# EAGLE design atsamd21_breakout_board (EAGLE 7.7.0)
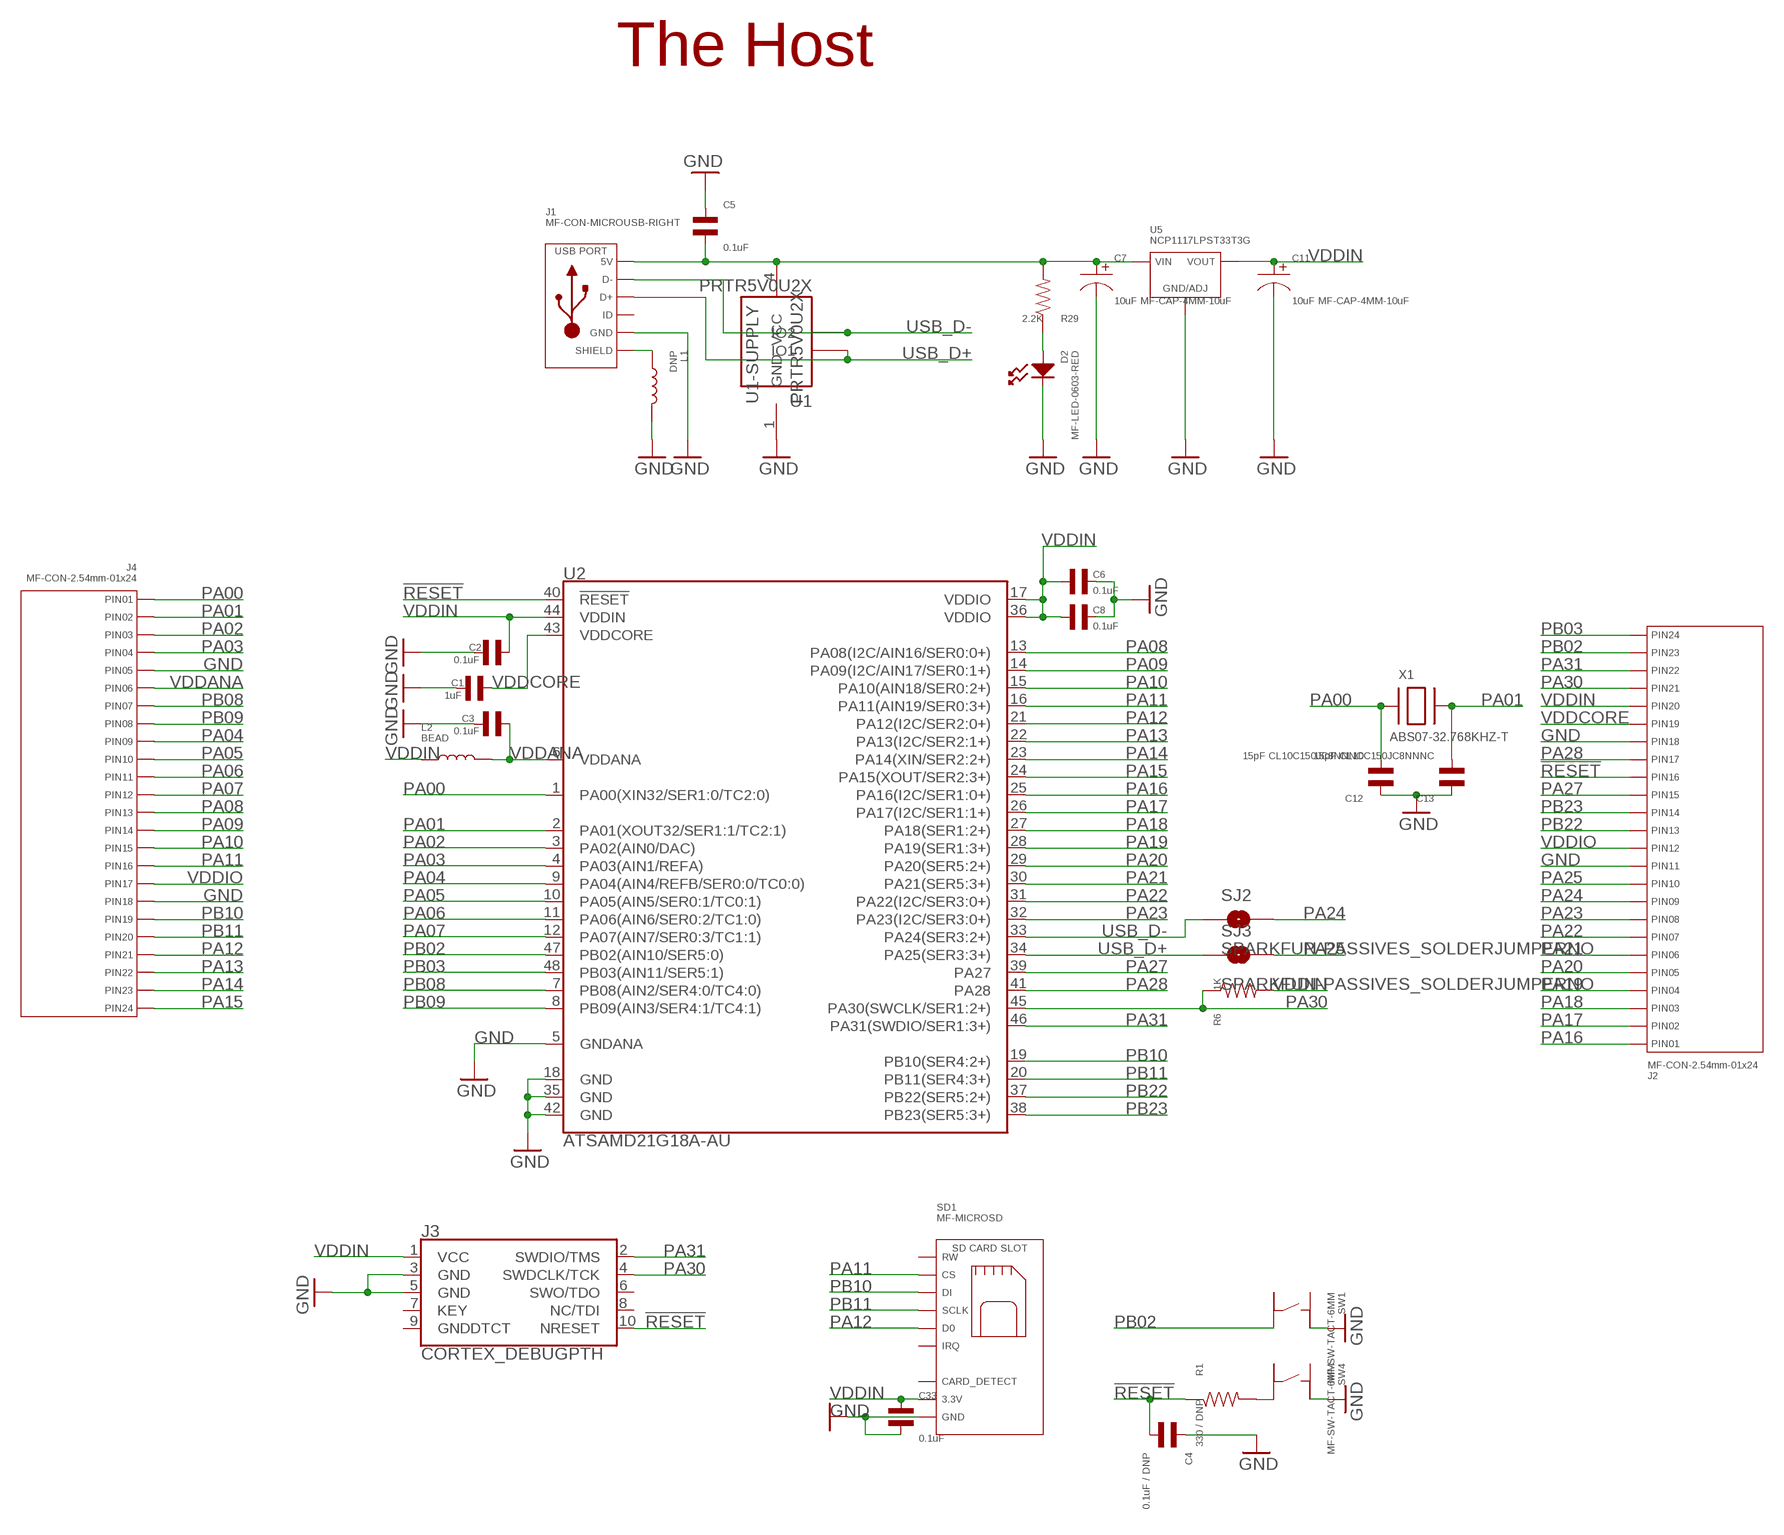
[diagram p0: schematic, sheet 1]

## Parts
C1  1uF  CAPACITOR_NP_0603  [C0603]
C2  0.1uF  CAPACITOR_NP_0603  [C0603]
C3  0.1uF  CAPACITOR_NP_0603  [C0603]
C4  0.1uF / DNP  CAPACITOR_NP_0603  [C0603]
C5  0.1uF  CAPACITOR_NP_0603  [C0603]
C6  0.1uF  CAPACITOR_NP_0603  [C0603]
C7  10uF MF-CAP-4MM-10uF  CAPACITOR_P_4MM  [CP4MM]
C8  0.1uF  CAPACITOR_NP_0603  [C0603]
C11  10uF MF-CAP-4MM-10uF  CAPACITOR_P_4MM  [CP4MM]
C12  15pF CL10C150JC8NNNC  CAPACITOR_NP_0603  [C0603]
C13  15pF CL10C150JC8NNNC  CAPACITOR_NP_0603  [C0603]
C33  0.1uF  CAPACITOR_NP_0603  [C0603]
D2  MF-LED-0603-RED  LED_SINGLE-0603-RED  [LED0603]
J1  MF-CON-MICROUSB-RIGHT  USB_MICRO_RIGHT  [MICROUSB-RIGHT]
J2  MF-CON-2.54mm-01x24  CON_01X24_PTH_2.54MM  [PTH_2.54MM_01X24]
J3  CORTEX_DEBUGPTH  [2X5-PTH-1.27MM]
J4  MF-CON-2.54mm-01x24  CON_01X24_PTH_2.54MM  [PTH_2.54MM_01X24]
L1  DNP  INDUCTOR_1210  [L1210]
L2  BEAD  INDUCTOR_1210  [L1210]
R1  330 / DNP  RESISTOR_0603  [R0603]
R6  1K  RESISTOR_0603  [R0603]
R29  2.2K  RESISTOR_0603  [R0603]
SD1  MF-MICROSD  SD_CARD_SLOT_MICRO_RIGHT  [MF-MICROSD]
SJ2  SPARKFUN-PASSIVES_SOLDERJUMPERNO  [SPARKFUN-PASSIVES_SJ_2S-NO]
SJ3  SPARKFUN-PASSIVES_SOLDERJUMPERNO  [SPARKFUN-PASSIVES_SJ_2S-NO]
SW1  MF-SW-TACT-6MM  TACT_6MM  [TACT6MM]
SW4  MF-SW-TACT-6MM  TACT_6MM  [TACT6MM]
U1  PRTR5V0U2X  [SOT-143B]
U2  ATSAMD21G18A-AU  ATSAMD21G-A  [TQFP-48]
U5  NCP1117LPST33T3G  [SOT-223-3]
X1  ABS07-32.768KHZ-T  XTAL-3.2X1.5  [XTAL3215]

## Nets
!RESET: C4.P$2 J2.P$16(PIN16) J3.10(NRESET) R1.P$1 U2.40(!RESET!)
GND [Power]: C1.P$2 C2.P$1 C3.P$1 C4.P$1 C5.P$1 C6.P$1 C7.P$2 C8.P$1 C11.P$2 C12.P$1 C13.P$1 C33.P$2 D2.CATHODE J1.5(GND) J2.P$11(PIN11) J2.P$18(PIN18) J3.3(GND) J3.5(GND) J4.P$5(PIN5) J4.P$18(PIN18) L1.P$2 SD1.G0(GND) SD1.G1(GND) SD1.PIN6(GND) SW1.P$2 SW4.P$2 U1.1(GND) U2.5(GNDANA) U2.18(GND) U2.35(GND) U2.42(GND) U5.P$2(GND/ADJ)
N$9: R1.P$2 SW4.P$4
N$10: J1.S1(SLD) J1.S2(SLD) J1.S3(SLD) J1.S4(SLD) J1.S5(SLD) J1.S6(SLD) L1.P$1
N$18: D2.ANODE R29.P$1
N$25: C5.P$2 C7.P$1 J1.1(5V) R29.P$2 U1.4(VCC) U5.P$4(VIN)
PA00: C12.P$2 J4.P$1(PIN1) U2.1(PA00(XIN32/SER1:0/TC2:0)) X1.P$1
PA01: C13.P$2 J4.P$2(PIN2) U2.2(PA01(XOUT32/SER1:1/TC2:1)) X1.P$2
PA02: J4.P$3(PIN3) U2.3(PA02(AIN0/DAC))
PA03: J4.P$4(PIN4) U2.4(PA03(AIN1/REFA))
PA04: J4.P$9(PIN9) U2.9(PA04(AIN4/REFB/SER0:0/TC0:0))
PA05: J4.P$10(PIN10) U2.10(PA05(AIN5/SER0:1/TC0:1))
PA06: J4.P$11(PIN11) U2.11(PA06(AIN6/SER0:2/TC1:0))
PA07: J4.P$12(PIN12) U2.12(PA07(AIN7/SER0:3/TC1:1))
PA08: J4.P$13(PIN13) U2.13(PA08(I2C/AIN16/SER0:0+))
PA09: J4.P$14(PIN14) U2.14(PA09(I2C/AIN17/SER0:1+))
PA10: J4.P$15(PIN15) U2.15(PA10(AIN18/SER0:2+))
PA11: J4.P$16(PIN16) SD1.PIN2(CS) U2.16(PA11(AIN19/SER0:3+))
PA12: J4.P$21(PIN21) SD1.PIN7(D0) U2.21(PA12(I2C/SER2:0+))
PA13: J4.P$22(PIN22) U2.22(PA13(I2C/SER2:1+))
PA14: J4.P$23(PIN23) U2.23(PA14(XIN/SER2:2+))
PA15: J4.P$24(PIN24) U2.24(PA15(XOUT/SER2:3+))
PA16: J2.P$1(PIN1) U2.25(PA16(I2C/SER1:0+))
PA17: J2.P$2(PIN2) U2.26(PA17(I2C/SER1:1+))
PA18: J2.P$3(PIN3) U2.27(PA18(SER1:2+))
PA19: J2.P$4(PIN4) U2.28(PA19(SER1:3+))
PA20: J2.P$5(PIN5) U2.29(PA20(SER5:2+))
PA21: J2.P$6(PIN6) U2.30(PA21(SER5:3+))
PA22: J2.P$7(PIN7) U2.31(PA22(I2C/SER3:0+))
PA23: J2.P$8(PIN8) U2.32(PA23(I2C/SER3:0+))
PA24: J2.P$9(PIN9) SJ2.2
PA25: J2.P$10(PIN10) SJ3.2
PA27: J2.P$15(PIN15) U2.39(PA27)
PA28: J2.P$17(PIN17) U2.41(PA28)
PA30: J2.P$21(PIN21) J3.4(SWDCLK/TCK) R6.P$1 U2.45(PA30(SWCLK/SER1:2+))
PA31: J2.P$22(PIN22) J3.2(SWDIO/TMS) U2.46(PA31(SWDIO/SER1:3+))
PB02: J2.P$23(PIN23) SW1.P$4 U2.47(PB02(AIN10/SER5:0))
PB03: J2.P$24(PIN24) U2.48(PB03(AIN11/SER5:1))
PB08: J4.P$7(PIN7) U2.7(PB08(AIN2/SER4:0/TC4:0))
PB09: J4.P$8(PIN8) U2.8(PB09(AIN3/SER4:1/TC4:1))
PB10: J4.P$19(PIN19) SD1.PIN3(DI) U2.19(PB10(SER4:2+))
PB11: J4.P$20(PIN20) SD1.PIN5(SCLK) U2.20(PB11(SER4:3+))
PB22: J2.P$13(PIN13) U2.37(PB22(SER5:2+))
PB23: J2.P$14(PIN14) U2.38(PB23(SER5:3+))
USB_D+: J1.3(D+) SJ3.1 U1.2(IO1) U2.34(PA25(SER3:3+))
USB_D-: J1.2(D-) SJ2.1 U1.3(IO2) U2.33(PA24(SER3:2+))
VDDANA: C3.P$2 J4.P$6(PIN6) L2.P$2 U2.6(VDDANA)
VDDCORE: C1.P$1 J2.P$19(PIN19) U2.43(VDDCORE)
VDDIN: C2.P$2 C6.P$2 C8.P$2 C11.P$1 C33.P$1 J2.P$20(PIN20) J3.1(VCC) L2.P$1 R6.P$2 SD1.PIN4(3.3V) U2.17(VDDIO) U2.36(VDDIO) U2.44(VDDIN) U5.P$1(VOUT) U5.P$3(VOUT)
VDDIO: J2.P$12(PIN12) J4.P$17(PIN17)
Unconnected: J1.4(ID) J3.6(SWO/TDO) J3.7(KEY) J3.8(NC/TDI) J3.9(GNDDTCT) SD1.PIN1(RW) SD1.PIN8(IRQ) SD1.PIN9(CRD_DTCT) SD1.PIN10(CRD_DTCT) SW1.P$1 SW1.P$3 SW4.P$1 SW4.P$3

## Notes on the sheet
- The Host

## Library data of the parts
C1-C6 C8 C12 C13 C33 = MF_Passives:CAPACITOR_NP: Library: MF_Passives Description: Device for Non-Polarized Capacitors. Manufacture part number (MPN) can be added via Attributes. Check https://factory.macrofab.com/parts for the house parts list.; POPULATE: 1
C7 C11 = MF_Passives:CAPACITOR_P: Library: MF_Passives Description: Device for Polarized Capacitors. Manufacture part number (MPN), Voltage Rating, and Tolerance can be added via Attributes. Check https://factory.macrofab.com/parts for the house parts list.; POPULATE: 1
D2 = MF_LEDs:LED_SINGLE: Library: MF_LEDs Description: Device for Single LED Packages. Manufacture part number (MFG#) can be added via Attributes.; HOUSEPART: YES; MPN: MF-LED-0603-RED; POPULATE: 1; URL: https://factory.macrofab.com/part/MF-LED-0603-RED
J1 = MF_Connectors:USB: Library: MF_Connectors Description: 5 Pin USB Connectors. SLD is the shield connection. Usually tied to ground through a small ferrite bead.; HOUSEPART: YES; MPN: MF-CON-MICROUSB-RIGHT; POPULATE: 1; URL: https://factory.macrofab.com/part/MF-CON-MICROUSB-RIGHT
J2 J4 = MF_Connectors:CON_01X24: Library: MF_Connectors Description: Header Connector with 24 Positions and 01 Rows. Use the LABEL Attribute to label the pin on the schematic and PCB. You can remove the attributes on the PCB by using the SMASH function on the part and then deleting the text.; HOUSEPART: YES; MPN: MF-CON-2.54mm-01x24; POPULATE: 1; URL: https://factory.macrofab.com/part/MF-CON-2.54mm-01x24
J3 = SparkFun-Connectors:CORTEX_DEBUG: Cortex Debug Connector Datasheet <http://infocenter.arm.com/help/topic/com.arm.doc.faqs/attached/13634/cortex_debug_connectors.pdf>
L1 L2 = MF_Passives:INDUCTOR: Library: MF_Passives Description: Device for Inductors. Manufacture part number (MPN) can be added via Attributes. Check https://factory.macrofab.com/parts for the house parts list.
R1 R6 R29 = MF_Passives:RESISTOR: Library: MF_Passives Description: Device for Resistors. Manufacture part number (MPN), Voltage, Tolerance, and Wattage Rating can be added via Attributes. Check https://factory.macrofab.com/parts for the house parts list.; POPULATE: 1
SD1 = MF_Connectors:SD_CARD_SLOT: Library: MF_Connectors Description: SD Card Connector; HOUSEPART: YES; MPN: MF-MICROSD; POPULATE: 1; URL: https://factory.macrofab.com/part/MF-MICROSD
SJ2 SJ3 = passKeyDev2:SPARKFUN-PASSIVES_SOLDERJUMPER: Solder Jumper Standard SMD solder jumper. Used to automate production. Two varients : Normally Open and Normally Closed are the same, but have different paste layers. NC will have a large amount of paste and should jumper during reflow.
SW1 SW4 = MF_Switches:TACT: Library: MF_Switches Description: Device for Tact Switches. Manufacture part number (MFG#) can be added via Attributes.; HOUSEPART: YES; MPN: MF-SW-TACT-6MM; POPULATE: 1; URL: https://factory.macrofab.com/part/MF-SW-TACT-6MM
U1 = Volks73-NXPSemiconductors:PRTR5V0U2X?: I2C-Bus EDS Protection Ulta low capacitance double rail-to-rail ESD protection diode Documentation Datasheet <http://www.nxp.com/documents/data_sheet/PRTR5V0U2X.pdf> General Description Ultra low capacitance rail-to-rail ElectroStatic Discharge (ESD) protection diode in a small SOT143B Surface-Mounted Device (SMD) plastic package designed to protect two Hi-Speed data lines or high-frequency signal lines from the damage caused by ESD and other transients. PRTR5V0U2X incorporates two pairs of ultra low capacitance rail-to-rail diodes as well as an additional ESD protection diode to ensure signal line protection even if no supply voltage is available. Features ESD protection of two Hi-Speed data lines or high-frequency signal lines Ultra low input/output to ground capacitance: C(I/O-GND) = 1 pF ESD protection up to 8kV IEC 61000-4-2, level 4 (ESD) Very low clamping voltage due to an integrated additional ESD protection diode Very low reverse current Small SMD plastic package Applications USB 2.0 ports Digital Video Interface (DVI)/High Definition Multimedia Interface (HDMI) interfaces Mobile and cordless phones Personal Digital Assistants (PDA) Digital Cameras Wide Area Network (WAN) / Local Area Network (LAN) systems PCs, notebooks, printers, and other PC peripherals; APPLICATIONS: General Purpose; BIDIRECTIONAL_CHANNELS: 2; CAPACITANCE: 1pF @ 1MHz; CURRENT_PEAK_PULSE: -; DESCRIPTION: TVS DIODE 5.5VWM SOT143B; DOCUMENTATION_LINK: <a href="http://www.nxp.com/documents/data_sheet/PRTR5V0U2X.pdf">Datasheet</a>; DOCUMENTATION_URL: http://www.nxp.com/documents/data_sheet/PRTR5V0U2X.pdf; MANUFACTURER: NXP Semiconductors; MOUNTING_TYPE: Surface Mount; OPERATING_TEMPERATURE: -40C ~ 85C; PART_NUMBER: PRTR5V0U2X,215; POWER-PEAK_PULSE: -; POWER_LINE_PROTECTION: Yes; SUPPLIER_ITEM_LINK: <a href="http://www.digikey.com/product-detail/en/PRTR5V0U2X,215/568-4140-1-ND/1589981">Details</a>; SUPPLIER_ITEM_NUMBER: 568-4140-1-ND; SUPPLIER_ITEM_URL: http://www.digikey.com/product-detail/en/PRTR5V0U2X,215/568-4140-1-ND/1589981; SUPPLIER_LINK: <a href="http://www.digikey.com">Home Page</a>; SUPPLIER_NAME: Digi-Key; SUPPLIER_URL: http://www.digikey.com; TYPE: Steering (Rail to Rail); UNIDIRECTIONAL_CHANNELS: -; VOLTAGE_BREAKDOWN: 6V; VOLTAGE_CLAMPING: -; VOLTAGE_REVERSE: 5.5V
U2 = SparkFun-DigitalIC:ATSAMD21G: Atmel SAMD21G SMART ARM-Based Microcontroller The Atmel ® | SMART ™ SAM D21 is a series of low-power microcontrollers using the 32-bit ARM ® Cortex ® -M0+ processor, and ranging from 32- to 64-pins with up to 256KB Flash and 32KB of SRAM. The SAM D21 devices operate at a maximum frequency of 48MHz and reach 2.46 CoreMark/MHz. They are designed for simple and intuitive migration with identical peripheral modules, hex compatible code, identical linear address map and pin compatible migration paths between all devices in the product series. All devices include intelligent and flexible peripherals, Atmel Event System for inter-peripheral signaling, and support for capacitive touch button, slider and wheel user interfaces.; PROD_ID: IC-13064
U5 = MF_IC_Power:NCP1117LP: Manufacturer Part #: NCP1117LP Manufacturer: ON Semiconductor Description: LDO Voltage Regulators; HOUSEPART: NO; MPN: NCP1117LPST33T3G; POPULATE: 1; URL: http://www.onsemi.com/pub_link/Collateral/NCP1117LP-D.PDF
X1 = adafruit:XTAL: Low cost SMT crystals, no capacitors included http://www.ladyada.net/library/eagle

## Net classes
1 Power: width 0.406 mm, clearance 0.203 mm

## Board
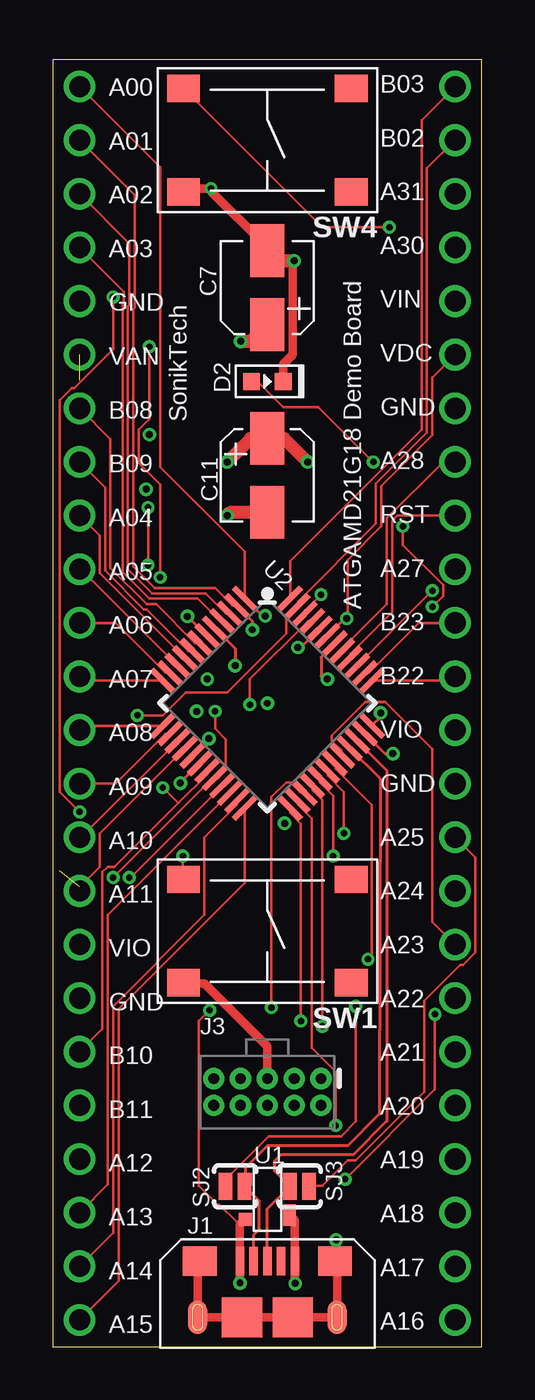
[diagram p1: board, top side]
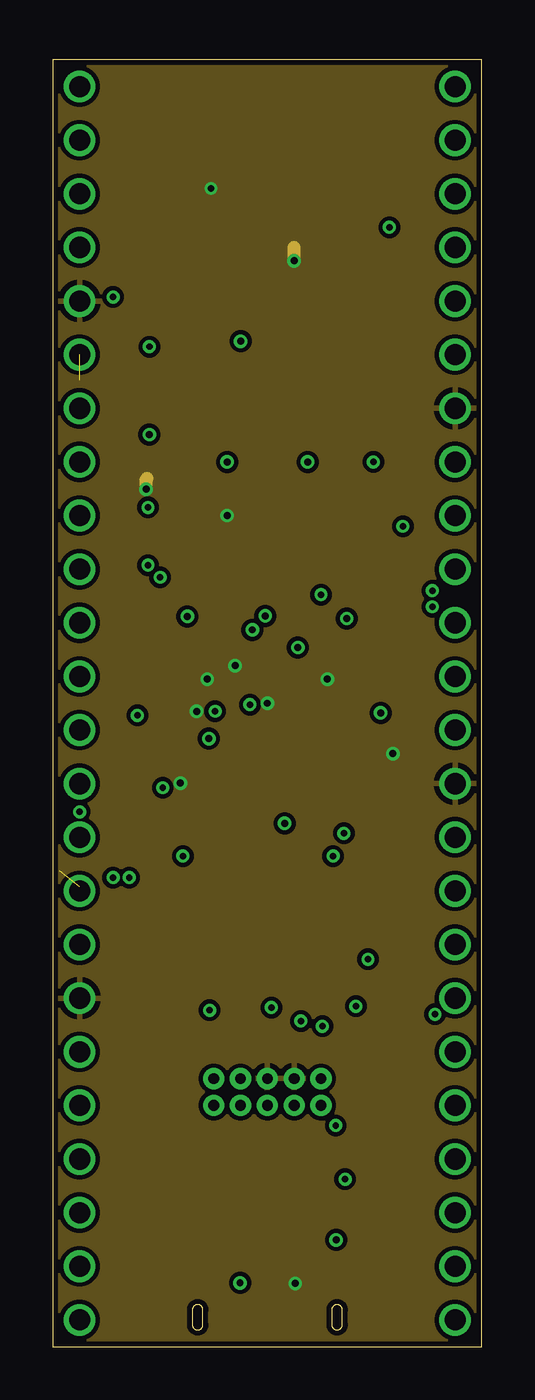
[diagram p2: board, inner layer Route2]
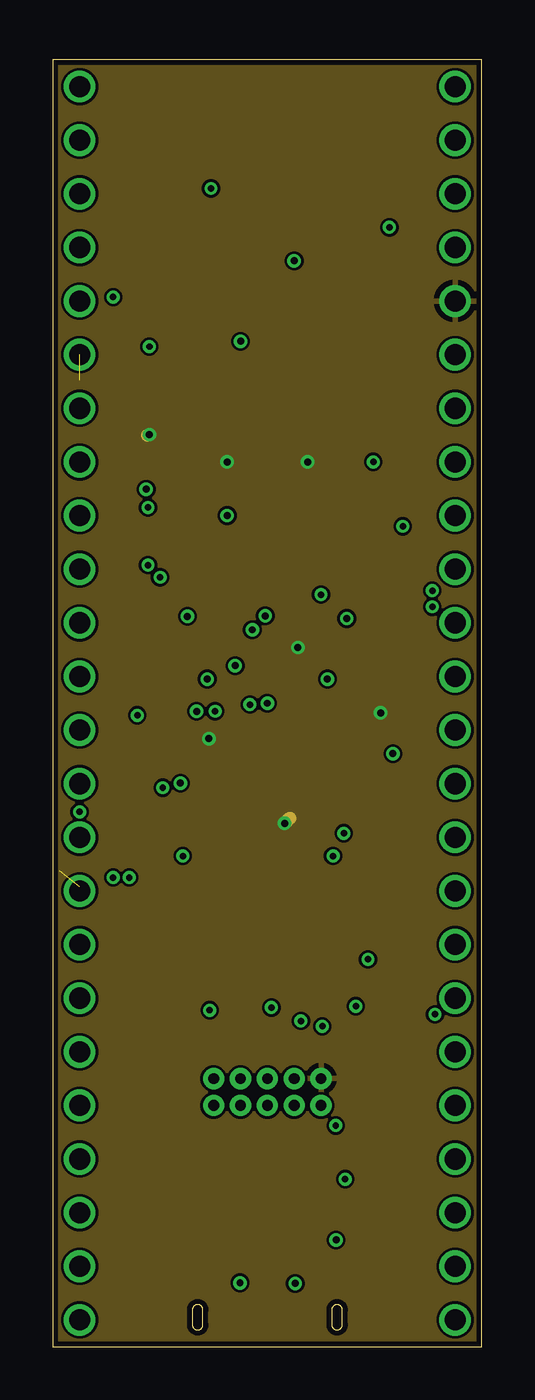
[diagram p3: board, inner layer Route15]
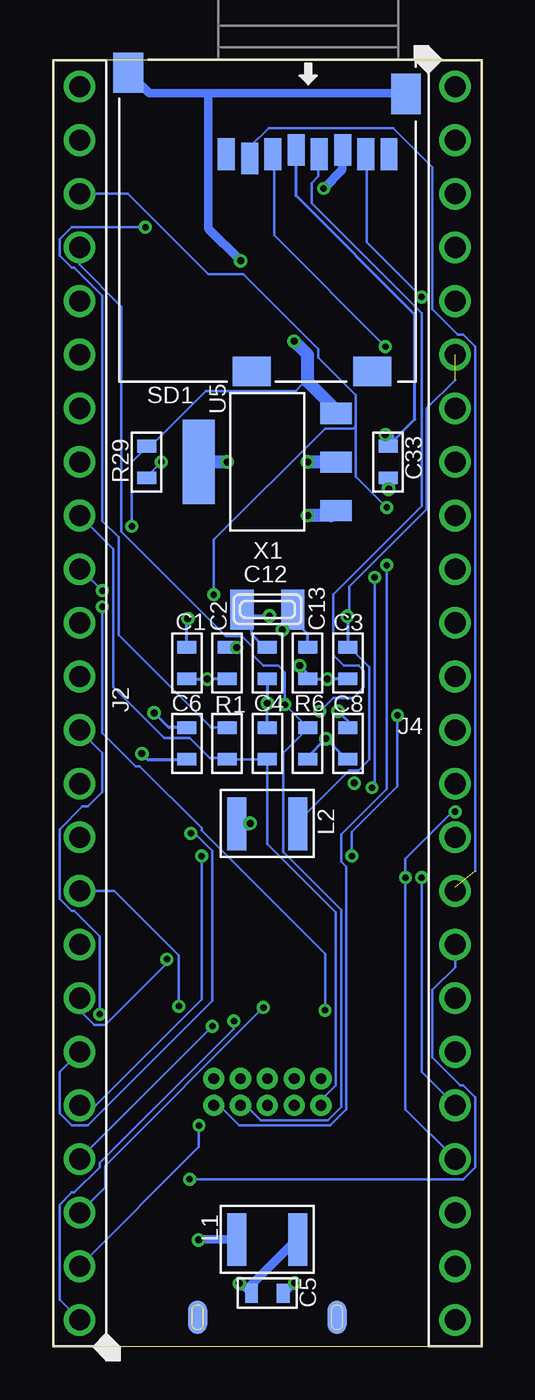
[diagram p4: board, bottom side, seen from below]

Size 20.32 x 60.96 mm. Coordinates in mm from the lower left corner, seen from the top.
Outline: 0,0 20.32,0 20.32,60.96 0,60.96 0,0
Copper layers (1*2*15*16): Top 0.035mm / dielectric 0.23mm / Route2 0.035mm / dielectric 0.93mm / Route15 0.035mm / dielectric 0.23mm / Bottom 0.035mm
Design rules "MF_Standard_4_Layer": minimum track width 5mil, minimum drill 12mil, track to track 5mil, track to pad 5mil, pad to pad 5mil, via to via 5mil, smd to smd 0mil, copper to edge 10mil, drill to drill 10mil, minimum pad ring 6mil, minimum via ring 6mil, stop-mask expansion 2mil, vias tented up to drill 25mil, thermal gap 10mil

### Footprints (pad centres in the part's own frame; a part is rotated, then mirrored left to right if it is on the bottom)
C0603 = smd 0.6 x 0.9: P$1 -0.75,0; P$2 0.75,0
CP4MM = smd 1.6 x 2.5: P$1 0,-1.75; P$2 0,1.75
LED0603 = smd 0.8 x 0.8: ANODE 0.75,0; CATHODE -0.75,0
MICROUSB-RIGHT = smd 0.4 x 1.35: 1 -1.3,1.27; 2 -0.65,1.27; 3 0,1.27; 4 0.65,1.27; 5 1.3,1.27 | smd 0.9 x 1.6: S1 -3.3,-1.4; S2 3.3,-1.4 | smd 1.6 x 1.4: S3 -3.2,1.27; S4 3.2,1.27 | smd 1.9 x 1.9: S5 -1.2,-1.405; S6 1.2,-1.405 | smd 0.9 x 1.6 bottom: S7 -3.3,-1.4; S8 3.3,-1.4
PTH_2.54MM_01X24 = drill 1: P$1 -29.21,0; P$2 -26.67,0; P$3 -24.13,0; P$4 -21.59,0; P$5 -19.05,0; P$6 -16.51,0; P$7 -13.97,0; P$8 -11.43,0; P$9 -8.89,0; P$10 -6.35,0; P$11 -3.81,0; P$12 -1.27,0; P$13 1.27,0; P$14 3.81,0; P$15 6.35,0; P$16 8.89,0; P$17 11.43,0; P$18 13.97,0; P$19 16.51,0; P$20 19.05,0; P$21 21.59,0; P$22 24.13,0; P$23 26.67,0; P$24 29.21,0
2X5-PTH-1.27MM = drill 0.508 pad 1: 1 -2.54,-0.635; 2 -2.54,0.635; 3 -1.27,-0.635; 4 -1.27,0.635; 5 0,-0.635; 6 0,0.635; 7 1.27,-0.635; 8 1.27,0.635; 9 2.54,-0.635; 10 2.54,0.635
L1210 = smd 0.9 x 2.5: P$1 -1.45,0; P$2 1.45,0
R0603 = smd 0.6 x 0.9: P$1 -0.75,0; P$2 0.75,0
MF-MICROSD = smd 1.4 x 1.9: G0 -6.589,7.001; G1 6.561,6.001 | smd 0.8 x 1.5: PIN1 -1.939,3.151; PIN2 -0.839,2.951; PIN3 0.261,3.151; PIN4 1.361,3.351; PIN5 2.461,3.151; PIN6 3.561,3.351; PIN7 4.661,3.151; PIN8 5.761,3.151 | smd 1.8 x 1.4: PIN9 4.961,-7.149; PIN10 -0.739,-7.149
SPARKFUN-PASSIVES_SJ_2S-NO = smd 0.635 x 1.27: 1 -0.45,0; 2 0.45,0
TACT6MM = smd 1.55 x 1.3: P$1 -3.975,2.45; P$2 3.975,2.45; P$3 -3.975,-2.45; P$4 3.975,-2.45
SOT-143B = smd 1 x 0.6: 1 -0.75,-1.05 | smd 0.6 x 0.6: 2 0.95,-1.05; 3 0.95,1.05; 4 -0.95,1.05
TQFP-48 = smd 1.5 x 0.28: 1 -4.25,2.75; 2 -4.25,2.25; 3 -4.25,1.75; 4 -4.25,1.25; 5 -4.25,0.75; 6 -4.25,0.25; 7 -4.25,-0.25; 8 -4.25,-0.75; 9 -4.25,-1.25; 10 -4.25,-1.75; 11 -4.25,-2.25; 12 -4.25,-2.75; 25 4.25,-2.75; 26 4.25,-2.25; 27 4.25,-1.75; 28 4.25,-1.25; 29 4.25,-0.75; 30 4.25,-0.25; 31 4.25,0.25; 32 4.25,0.75; 33 4.25,1.25; 34 4.25,1.75; 35 4.25,2.25; 36 4.25,2.75 | smd 0.28 x 1.5: 13 -2.75,-4.25; 14 -2.25,-4.25; 15 -1.75,-4.25; 16 -1.25,-4.25; 17 -0.75,-4.25; 18 -0.25,-4.25; 19 0.25,-4.25; 20 0.75,-4.25; 21 1.25,-4.25; 22 1.75,-4.25; 23 2.25,-4.25; 24 2.75,-4.25; 37 2.75,4.25; 38 2.25,4.25; 39 1.75,4.25; 40 1.25,4.25; 41 0.75,4.25; 42 0.25,4.25; 43 -0.25,4.25; 44 -0.75,4.25; 45 -1.25,4.25; 46 -1.75,4.25; 47 -2.25,4.25; 48 -2.75,4.25
SOT-223-3 = smd 1.5 x 4: P$1 3.25,0 | smd 1.5 x 1: P$2 -3.25,2.3; P$3 -3.25,0; P$4 -3.25,-2.3
XTAL3215 = smd 1.1 x 1.9: P$1 1.2,0; P$2 -1.2,0

### Placement (x,y rotation side)
C1  13.97,32.38 270 bottom
C2  12.06,32.38 90 bottom
C3  6.35,32.38 90 bottom
C4  10.16,28.57 270 bottom
C5  10.16,2.54 0 bottom
C6  13.97,28.57 90 bottom
C7  10.16,50.16 0 top
C8  6.35,28.57 270 bottom
C11  10.16,41.27 180 top
C12  10.16,32.38 90 bottom
C13  8.26,32.38 90 bottom
C33  4.45,41.91 270 bottom
D2  10.16,45.72 180 top
J1  10.16,2.79 0 top
J2  19.05,30.48 90 bottom
J3  10.16,12.06 180 top
J4  1.27,30.48 270 bottom
L1  10.16,5.08 0 bottom
L2  10.16,24.77 0 bottom
R1  12.06,28.57 90 bottom
R6  8.26,28.57 270 bottom
R29  15.88,41.91 90 bottom
SD1  10.16,53.34 0 bottom
SJ2  8.64,7.59 180 top
SJ3  11.68,7.59 0 top
SW1  10.16,19.68 180 top
SW4  10.16,57.15 180 top
U1  10.16,6.99 90 top
U2  10.16,30.48 315 top
U5  10.16,41.91 180 bottom
X1  10.16,34.92 180 bottom

### Tracks (layer width: path | path; a pad name or v marks a point on that pad's centre or on a via)
!RESET
  Top 0.127: U2.40 14.1,32.64 14.1,32.83 16.07,34.8 16.07,39.12 16.32,39.37 J2.P$16
  Bottom 0.127: C4.P$2 R1.P$1 12.06,27.88 12.89,27.88 13.84,28.83 15.05,28.83 17.46,31.24 17.46,37.78 J2.P$16 | J3.10 7.62,11.68 6.92,12.38 6.92,20.57 10.16,23.81 C4.P$2 | C4.P$2
GND  (via drill 0.3, 0.33)
  Top 0.152: U2.35 15.72,28.09 v16.1,28.09 | U2.42 12.7,32.67 12.7,31.75 12.83,31.62 v13.01,31.62 | U2.18 6.04,26.72 v6.04,26.7 | U2.5 8.64,33.06 v8.64,32.26
  Top 0.406: v11.48,3 11.46,3.03 J1.5 11.46,5.99 U1.1 | SW4.P$2 6.22,54.74 6.35,54.86 v7.49,54.86 7.56,54.67 10.03,52.2 C7.P$2 | D2.CATHODE 10.92,45.72 10.92,46.55 11.37,46.99 11.37,51.18 v11.43,51.44 | J3.5 10.16,14.22 7.18,17.21 6.22,17.21 SW1.P$2
  Top 0.61: v8.26,39.37 8.41,39.52 C11.P$2 | C7.P$2 10.64,51.44 v11.43,51.44
  Route2 0.152: v7.32,31.62 7.32,31.55 | v10.16,30.48 10.16,30.61 | v13.01,31.62 13.11,31.62 | v6.81,30.1 6.71,30.1 6.68,30.12 | v6.04,26.7 6.12,26.77 6.12,26.8
  Route2 0.61: v4.42,40.62 4.42,41.07 4.47,41.12 | v11.43,51.44 11.43,52.07
  Bottom 0.152: C3.P$1 7.3,31.64 v7.32,31.62 7.33,31.64 C13.P$1 8.26,31.88 v8.64,32.26 | C4.P$1 v10.16,30.48 C12.P$1 | C2.P$1 12.99,31.64 v13.01,31.62 13.02,31.64 C1.P$2 | C8.P$1 6.35,29.64 v6.81,30.1 | C6.P$1 15.84,27.82 v16.1,28.09
  Bottom 0.406: v11.48,3 10.96,2.59 C5.P$1 10.99,2.86 8.76,5.08 L1.P$2 | 12.95,59.37 15.75,59.37 16.7,60.33 SD1.G0 | 12.95,59.37 3.62,59.37 SD1.G1 | v7.49,54.86 6.6,55.75 6.6,56.64 SD1.PIN6 | 12.95,59.37 12.95,52.96 v11.43,51.44
  Bottom 0.61: C33.P$2 4.45,40.64 v4.42,40.62 | U5.P$2 7.15,39.37 v8.26,39.37
  pour Route2: 0,60.96 20.32,60.96 20.32,0 0,0
N$9  (via drill 0.3)
  Top 0.127: v15.94,53.02 12.76,53.02 6.22,59.56 SW4.P$4
  Bottom 0.127: v15.94,53.02 19.43,53.02 20,52.45 20,51.69 19.43,51.12 19.3,51.12 17.97,49.78 17.97,39.12 17.21,38.35 17.21,33.72 12.83,29.34 12.06,29.34 R1.P$2
N$10  (via drill 0.33)
  Top 0.406: J1.S3 6.86,3.96 J1.S1 J1.S5 J1.S6 J1.S2 13.46,3.96 J1.S4 13.41,4.12 v13.41,5.05
  Bottom 0.406: L1.P$1 13.39,5.08 v13.41,5.05
N$18  (via drill 0.3)
  Top 0.127: D2.ANODE 9.72,45.72 10.92,44.51 12.57,44.51 v15.18,41.91
  Bottom 0.127: v15.18,41.91 15.88,41.21 R29.P$1
N$25  (via drill 0.3, 0.33)
  Top 0.127: v7.43,15.94 6.92,15.43 6.92,7.62 7.81,6.73 7.87,6.73 8.7,5.91 8.86,5.79 | v17.97,35.05 18.48,35.56 18.48,36.07 16.57,37.97 v16.57,38.86
  Top 0.406: v8.87,3.02 8.86,3.05 J1.1 8.86,5.79 U1.4
  Top 0.61: v8.89,47.62 9.37,47.62 C7.P$1
  Bottom 0.127: 8.26,45.72 8.51,45.59 8.83,45.28 13.08,45.28 15.68,42.67 15.88,42.67 R29.P$2 15.88,42.61 16.57,41.91 v16.57,38.86 | v7.43,15.94 7.43,18.61 13.27,24.45 13.27,24.57 16.19,27.5 16.38,27.5 17.97,29.08 v17.97,35.05
  Bottom 0.406: v8.87,3.02 9.38,2.56 C5.P$2
  Bottom 0.61: U5.P$4 6.91,44.38 8.26,45.72 8.26,46.99 v8.89,47.62
PA00  (via drill 0.33)
  Top 0.127: U2.1 9.08,35.5 9.08,37.66 5.08,41.66 5.08,55.88 J4.P$1
  Top 0.152: U2.1 9.91,34.65 9.91,34.62 v10.06,34.62
  Bottom 0.152: C12.P$2 10.3,33.13 10.9,33.73 10.9,34.46 11.05,34.62 | v10.06,34.62 11.05,34.62 | 11.05,34.62 X1.P$1
PA01  (via drill 0.33)
  Top 0.127: U2.2 8.7,35.12 8.51,35.12 7.68,35.94 4.83,35.94 3.81,36.96 3.81,49.15 3.87,49.21 3.87,54.55 J4.P$2
  Top 0.152: U2.2 9.45,34.37 v9.45,33.96
  Bottom 0.152: C13.P$2 8.26,33.76 8.53,34.04 8.53,34.5 X1.P$2 8.96,34.45 v9.45,33.96
PA02
  Top 0.127: U2.3 8.38,34.73 8.19,34.73 7.24,35.69 4.7,35.69 3.56,36.83 3.56,49.28 3.62,49.34 3.62,52.26 J4.P$3
PA03
  Top 0.127: U2.4 8,34.42 7.87,34.42 6.86,35.43 4.57,35.43 3.3,36.7 3.3,49.4 3.37,49.47 3.37,49.97 J4.P$4
PA04
  Top 0.127: U2.9 6.22,32.64 2.22,36.64 2.22,38.42 J4.P$9
PA05
  Top 0.127: U2.10 1.33,36.83
  Top 0.152: 1.33,36.83 J4.P$10
PA06
  Top 0.127: U2.11 5.52,31.94 5.33,31.94 2.98,34.29 J4.P$11
PA07
  Top 0.127: 1.46,31.56 5.21,31.56 U2.12
  Top 0.152: 1.46,31.56 1.27,31.56 J4.P$12
PA08
  Top 0.127: 1.46,29.4 5.21,29.4 U2.13
  Top 0.152: 1.46,29.4 1.27,29.4 J4.P$13
PA09
  Top 0.127: U2.14 5.52,29.02 5.33,29.02 2.98,26.67 J4.P$14
PA10
  Top 0.127: 1.33,24.13 5.91,28.7 U2.15
  Top 0.152: 1.33,24.13 J4.P$15
PA11  (1 unrouted)
  Top 0.127: 1.27,21.78 2.22,22.73 2.22,24.32 6.22,28.32 U2.16
  Top 0.152: 1.27,21.78 J4.P$16
  Bottom 0.127: 0.32,22.54 0.32,47.37 0.89,47.94 1.14,47.94 2.35,49.15 2.35,55.88 4.19,57.72 10.1,57.72 10.99,56.83 10.99,56.33 SD1.PIN2
PA12  (via drill 0.3)
  Top 0.127: v3.62,22.23 3.68,22.23 8,26.54 U2.21 | v2.86,49.72 2.86,47.24 1.02,45.4 0.89,45.4 0.32,44.83 0.32,26.29 v1.27,25.34
  Bottom 0.127: v2.86,49.72 5.46,52.32 5.46,56.45 SD1.PIN7 | v1.27,25.34 1.4,25.34 3.62,23.11 v3.62,22.23 3.62,11.24 J4.P$21
PA13
  Top 0.127: U2.22 8.38,26.23 2.6,20.45 2.6,7.68 J4.P$22
PA14
  Top 0.127: U2.23 8.7,25.84 8.7,25.65 7.18,24.13 7.18,20.45 2.86,16.13 2.86,5.4 J4.P$23
PA15
  Top 0.127: U2.24 9.08,25.53 9.08,21.97 3.11,16 3.11,3.11 J4.P$24
PA16  (via drill 0.3)
  Top 0.127: v11.75,15.43 11.75,24.77 11.24,25.27 11.24,25.53 U2.25
  Bottom 0.127: v11.75,15.43 11.75,15.05 18.1,8.7 18.1,8.51 19.3,7.3 19.43,7.3 20,6.73 20,2.22 J2.P$1
PA17  (via drill 0.3)
  Top 0.127: v13.4,10.48 13.4,13.02 12.26,14.16 12.26,25.02 11.62,25.65 11.62,25.84 U2.26
  Bottom 0.127: v13.4,10.48 13.4,9.46 J2.P$2
PA18  (via drill 0.3)
  Top 0.127: v10.35,16.07 10.35,26.04 11.05,26.73 11.24,26.73 11.68,26.29 11.87,26.29 U2.27
  Bottom 0.127: v10.35,16.07 17.84,8.57 17.84,7.56 J2.P$3
PA19  (via drill 0.3)
  Top 0.127: v12.76,15.18 12.76,25.91 12.32,26.35 12.32,26.54 U2.28
  Bottom 0.127: v12.76,15.18 J2.P$4
PA20  (via drill 0.3)
  Top 0.127: v13.27,23.24 13.27,26.1 12.64,26.73 12.64,26.92 U2.29
  Bottom 0.127: v13.27,23.24 13.27,16.45 18.29,11.43
  Bottom 0.152: 18.29,11.43 J2.P$5
PA21  (via drill 0.3)
  Top 0.127: v13.78,24.32 13.78,26.29 13.02,27.05 13.02,27.24 U2.30
  Bottom 0.127: v13.78,24.32 13.59,24.32 12.76,23.5 12.76,16.38 18.67,10.48 19.43,10.48 20,11.05 20,13.02 J2.P$6
PA22  (via drill 0.3)
  Top 0.127: v14.92,18.35 15.11,18.54 15.11,25.65 13.4,27.37 13.4,27.62 U2.31
  Bottom 0.127: v14.92,18.35 14.92,18.16 17.84,15.24 18.35,15.24 19.05,15.94
  Bottom 0.152: 19.05,15.94 J2.P$7
PA23
  Top 0.127: U2.32 13.65,28.07 13.65,28.26 13.21,28.7 13.21,28.96 14.8,30.54 15.75,30.54 17.97,28.32 17.97,20.13 J2.P$8
PA24  (via drill 0.3)
  Top 0.127: v14.35,16.13 14.35,10.67 13.65,9.97 10.22,9.97 8.19,7.94 8.19,7.62 SJ2.2
  Bottom 0.127: v14.35,16.13 14.35,18.54 17.4,21.59 J2.P$9
PA25
  Top 0.127: SJ3.2 12.19,7.62 12.76,7.62 13.97,8.83 14.35,8.83 17.59,12.06 17.59,16.38 19.3,18.1 19.43,18.1 20,18.67 20,23.18 J2.P$10
PA27  (via drill 0.3)
  Top 0.127: v17.97,35.81 14.41,32.26 U2.39
  Bottom 0.127: v17.97,35.81 18.99,36.83 J2.P$15
PA28
  Top 0.127: U2.41 13.72,32.96 13.72,33.08 15.81,35.18 15.81,39.24 18.48,41.91 J2.P$17
PA30  (via drill 0.3)
  Top 0.127: v9.34,30.42 9.34,31.62 12.06,34.35 12.26,34.35 U2.45
  Bottom 0.127: J3.4 11.18,11.43 10.48,10.73 7.3,10.73 6.67,11.37 6.67,20.7 9.4,23.43 9.4,28.13 8.26,29.27 R6.P$1 8.26,29.34 v9.34,30.42 9.34,31.94 9.65,32.26 10.35,32.26 10.86,32.77 10.86,33.15 11.37,33.66 12.13,33.66 17.08,38.61 17.08,49.28 19.05,51.24 J2.P$21
PA31  (via drill 0.3)
  Top 0.127: v12.7,35.62 11.94,34.86 11.94,34.73 U2.46 | v4.51,39.75 v4.51,37.02
  Bottom 0.127: v12.7,35.62 12.7,38.23 7.43,43.5 6.1,43.5 6,43.59 | 6,43.59 5.97,43.62 5.97,45.09 7.75,46.86 7.75,47.24 11.3,50.8 12.95,50.8 16.76,54.61 J2.P$22 | J3.2 12.45,11.43 11.49,10.48 7.18,10.48 6.41,11.24 6.41,22.73 6.67,22.99 6.67,24.26 4.51,26.42 v4.51,37.02 | v4.51,39.75 5.97,41.21 5.97,43.56 6,43.59
PB02  (via drill 0.3)
  Top 0.127: v6.16,23.24 6.16,22.16 SW1.P$4 | v4,29.91 5.21,29.91 6.29,30.99 8.26,30.99 11.05,33.78 11.05,34.54 11.56,35.05 U2.47 11.62,35.12 11.62,35.31 15.3,38.99 15.3,40.89 17.72,43.31 17.72,55.82 J2.P$23
  Bottom 0.127: v6.16,23.24 6.16,24.38 4,26.54 v4,29.91
PB03
  Top 0.127: U2.48 11.24,35.43 11.24,37.21 17.46,43.43 17.46,58.1 J2.P$24
PB08
  Top 0.127: U2.7 6.92,33.34 6.73,33.34 4.89,35.18 4.45,35.18 2.73,36.89 2.73,42.99 J4.P$7
PB09
  Top 0.127: U2.8 6.6,32.96 6.41,32.96 4.45,34.92 4.32,34.92 2.48,36.77 2.48,40.7 J4.P$8
PB10  (via drill 0.3)
  Top 0.127: 5.94,25.75 2.92,22.73 2.6,22.73 2.35,22.48 2.35,15.24 2.35,15.05 J4.P$19 | 5.94,25.75 7.3,27.11 7.3,27.24 U2.19 | v4.57,47.37 4.57,43.94 4.06,43.43 4.06,41.85 5.08,40.83 v5.08,36.45 | 5.94,25.75 v5.21,26.48
  Bottom 0.127: v4.57,47.37 9.84,52.64 9.84,56.45 SD1.PIN3 | v5.08,36.45 5.08,26.61 v5.21,26.48
PB11  (via drill 0.3)
  Top 0.127: v2.86,22.23 7.56,26.92 7.68,26.92 U2.20 7.75,26.99 8.19,27.43 8.19,28.77 7.68,29.27 v7.68,30.1
  Bottom 0.127: v2.86,22.23 2.86,13.02 J4.P$20 | v7.68,30.1 7.05,30.73 6.1,30.73 5.59,31.24 5.59,32 5.84,32.26 6.54,32.26 7.05,32.77 7.05,35.62 2.86,39.81 2.86,48.96 8.06,54.17 8.06,55.12 7.75,55.44 7.75,56.45 SD1.PIN5
PB22
  Top 0.127: U2.37 15.11,31.56 18.86,31.56 J2.P$13
PB23
  Top 0.127: U2.38 14.8,31.94 14.99,31.94 17.34,34.29 J2.P$14
USB_D+
  Top 0.127: SJ3.1 11.24,7.62 11.24,7.87 U1.2
  Top 0.152: J1.3 10.16,6.52 SJ3.1 | U1.2 10.89,7.93 10.49,8.33 10.49,8.79 10.79,9.09 14.22,9.09 15.82,10.69 15.82,27.29 U2.34
USB_D-
  Top 0.127: SJ2.1 9.14,7.62 9.14,7.87 U1.3
  Top 0.152: U1.3 9.11,8.47 10.16,9.53 13.97,9.53 15.47,11.02 15.49,26.91 U2.33 | J1.2 9.51,5.29 9.78,5.56 9.78,6.9 SJ2.1
VDDANA  (via drill 0.33)  (1 unrouted)
  Top 0.152: U2.6 6.4,34.59 v6.38,34.59
  Bottom 0.127: C3.P$2 6.29,33.15 5.33,32.19 5.33,27.81 5.84,27.3 6.29,27.3 8.7,24.89 L2.P$2 | 1.27,45.78 2.6,44.45 2.6,39.69 6.29,36.01 6.29,34.61 v6.38,34.59
  Bottom 0.152: v6.38,34.59 6.35,34.57 C3.P$2
VDDCORE  (via drill 0.33)
  Top 0.127: v13.92,34.49 13.97,34.54 13.97,37.27 15.56,38.86 15.56,40.77 17.97,43.18 17.97,45.91 J2.P$19
  Top 0.152: v13.92,34.49 13.82,34.49 U2.43
  Bottom 0.152: C1.P$1 13.97,34.44 v13.92,34.49
VDDIN  (via drill 0.33)
  Top 0.152: v11.61,33.12 11.74,33.12 U2.44 | v15.52,30.02 15.52,29.83 U2.36 | v7.39,28.8 7.35,28.73 U2.17
  Top 0.61: v12.06,41.91 10.95,43.02 C11.P$1 9.37,43.02 v8.26,41.91
  Route15 0.61: v4.57,43.2 4.52,43.2 4.5,43.18 | v10.97,24.79 11.23,25.04
  Bottom 0.152: C2.P$2 v11.61,33.12 | C6.P$2 14.82,29.32 v15.52,30.02 | 7.3,28.78 v7.39,28.8 | R6.P$2 8.26,27.94 v7.39,28.8 | C8.P$2 6.41,27.82 v7.39,28.8 | C33.P$1 3.17,43.93 3.17,48.9 8.8,54.52 SD1.PIN4
  Bottom 0.61: C33.P$1 4.45,43.08 v4.57,43.2 | L2.P$1 11.02,24.77 v10.97,24.79 | v12.06,41.91 U5.P$1 | U5.P$3 v8.26,41.91
  pour Route15: 0,60.96 20.32,60.96 20.32,0 0,0
VDDIO  (via drill 0.3)
  Top 0.127: v13.84,7.94 18.1,12.19 v18.1,15.75
  Bottom 0.127: v13.84,7.94 0.89,7.94 0.32,8.51 0.32,11.81 0.89,12.38 1.02,12.38 2.35,13.72 2.35,16.89 1.27,17.97 J4.P$17 | v18.1,15.75 18.1,19.43 19.3,20.64 19.43,20.64 20,21.21 20,24.51 18.92,25.59 18.67,25.59 17.97,26.29 17.97,28.13 J2.P$12

### Text on the board
tNames: SonikTech | ATGAMD21G18 Demo Board | A00 / A01 / A02 / A03 / GND / VAN / B08 / B09 / A04 / A05 / A06 / A07 / A08 / A09 / A10 / A11 / VIO / GND / B10 / B11 / A12 / A13 / A14 / A15 | B03 / B02 / A31 / A30 / VIN / VDC / GND / A28 / RST / A27 / B23 / B22 / VIO / GND / A25 / A24 / A23 / A22 / A21 / A20 / A19 / A18 / A17 / A16